# Altium schematic sheet LDO.SchDoc
size A4; SheetNumber: 3; SheetTotal: 4
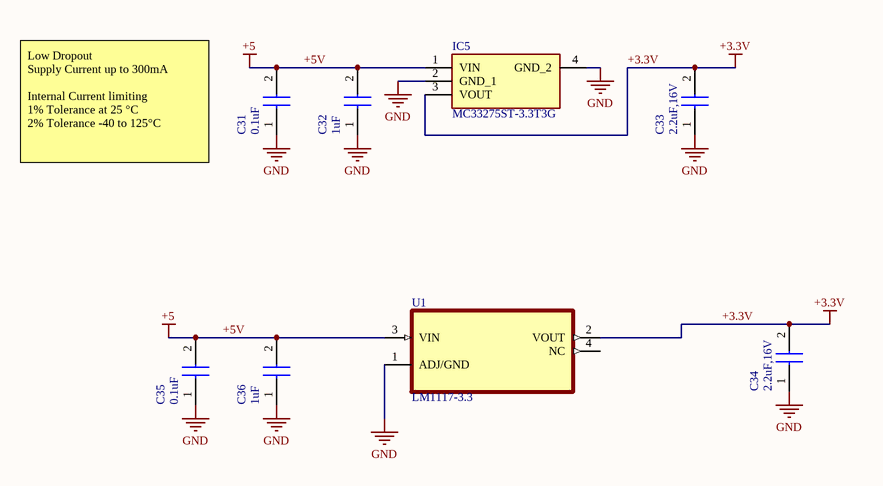
[diagram p0: LDO.SchDoc]

## Parts
C31  0.1uF  [CAPC1608X90N]
C32  1uF  [CAPC1608X90N]
C33  2.2uF,16V  [CAPC1608X90N]
C34  2.2uF,16V  [CAPC1608X90N]
C35  0.1uF  [CAPC1608X90N]
C36  1uF  [CAPC1608X90N]
IC5  MC33275ST-3.3T3G  [SOT230P700X175-4N]
U1  LM1117-3.3  [SOT230]

## Nets
+3.3V: C33.2 C34.2 IC5.3(VOUT) U1.2(VOUT)
+5V: C31.2 C32.2 C35.2 C36.2 IC5.1(VIN) U1.3(VIN)  [also labelled +5]
GND: C31.1 C32.1 C33.1 C34.1 C35.1 C36.1 IC5.2(GND_1) IC5.4(GND_2) U1.1(ADJ/GND)

Not connected (* = marked no-connect by the designer): U1 4(NC)

## Notes on the sheet
- Low Dropout
  Supply Current up to 300mA
  Internal Current limiting
  1% Tolerance at 25 °C
  2% Tolerance -40 to 125°C

## Library data of the parts
C31-C36 = EMK107B7104KAHT: Capacitor; Manufacturer_Name: TAIYO YUDEN; Datasheet Link: https://componentsearchengine.com/Datasheets/2/EMK107B7104KAHT.pdf; Height: 0.9mm; Manufacturer_Part_Number: EMK107B7104KAHT; Mouser Part Number: 963-EMK107B7104KAHT; Mouser Price/Stock: https://www.mouser.co.uk/ProductDetail/Taiyo-Yuden/EMK107B7104KAHT?qs=Va%252BXcMGJzEvYcymJV6GEGg%3D%3D
IC5 = MC33275ST-3.3T3G: Integrated Circuit; Manufacturer_Name: onsemi; Datasheet Link: http://www.onsemi.com/pub/Collateral/MC33275-D.PDF; Height: 1.75mm; Manufacturer_Part_Number: MC33275ST-3.3T3G; Mouser Part Number: 863-MC33275ST-3.3T3G; Mouser Price/Stock: https://www.mouser.co.uk/ProductDetail/ON-Semiconductor/MC33275ST-33T3G?qs=dFKnUM%2FquJbQYa4LZ%2FVbxA%3D%3D; Arrow Part Number: MC33275ST-3.3T3G; Arrow Price/Stock: https://www.arrow.com/en/products/mc33275st-3.3t3g/on-semiconductor
U1 = LM1117-3.3: Regulador de tensÃ£o linear IC 1 Output 800mA SOT-223-4; MF: Texas Instruments; MP: LM1117-3.3; Package: SOT-223-4 Texas Instruments; Price: None; Availability: Unavailable; SnapEDA_Link: https://www.snapeda.com/parts/LM1117-3.3/Texas%20Instruments/view-part/549181/?ref=snap; Value: *